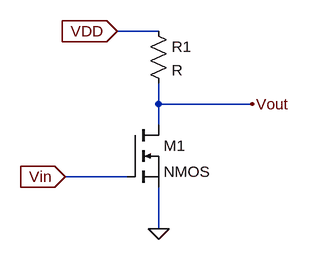
[diagram p0: schematic Draft1.asc]
Draft1.asc, the LTspice schematic file:
Version 4
SHEET 1 880 680
WIRE 224 -32 160 -32
WIRE 224 80 224 48
WIRE 368 80 224 80
WIRE 224 112 224 80
WIRE 176 192 80 192
WIRE 224 272 224 208
FLAG 224 272 0
FLAG 160 -32 VDD
IOPIN 160 -32 In
FLAG 368 80 Vout
FLAG 80 192 Vin
IOPIN 80 192 In
SYMBOL nmos 176 112 R0
SYMATTR InstName M1
SYMBOL res 208 -48 R0
SYMATTR InstName R1

The netlist it stands for:
* Draft1.asc
M1 Vout Vin 0 0 NMOS
R1 VDD Vout R
.model NMOS NMOS
.model PMOS PMOS
.lib standard.mos
.backanno
.end